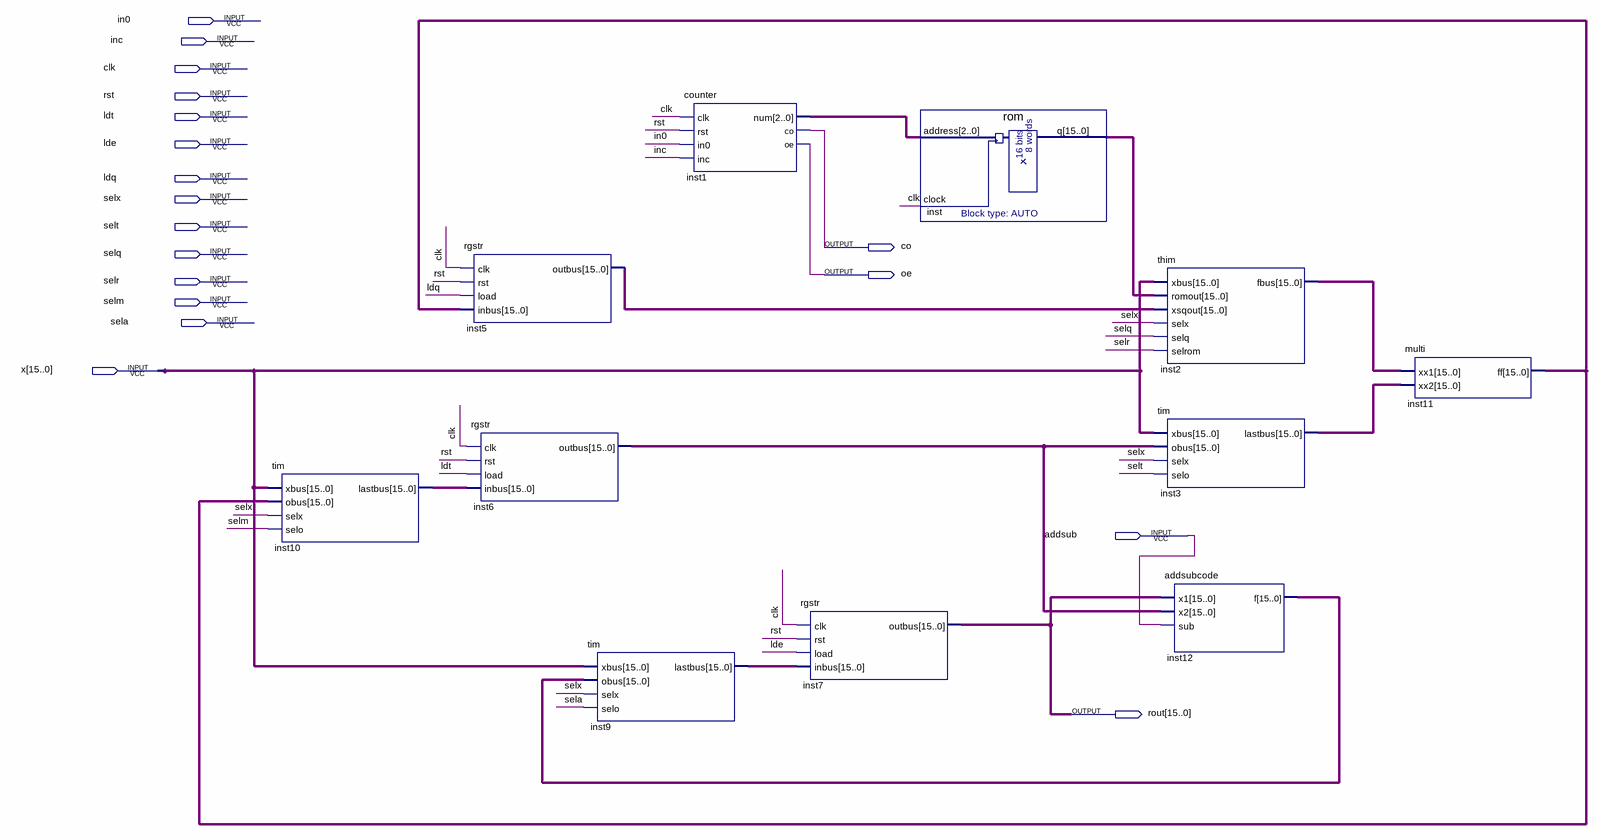
[diagram p0: schematic sheet]
// Quartus schematic datapath.bdf as structural Verilog: 11 symbols, 18 pins
module datapath (
  input  in0,
  input  inc,
  input  clk,
  input  rst,
  input  ldt,
  input  lde,
  input  ldq,
  input  selx,
  input  selt,
  input  selq,
  input  selr,
  input  selm,
  input  sela,
  input  [15:0] x,
  input  addsub,
  output co,
  output oe,
  output [15:0] rout
);

  wire [2:0] inst1_num;
  wire [15:0] inst2_fbus, inst3_lastbus, inst5_outbus, inst6_outbus, inst9_lastbus, inst10_lastbus,
       inst11_ff, inst12_f, inst_q;

  tim inst10 (.xbus(x), .obus(inst11_ff), .selx(selx), .selo(selm), .lastbus(inst10_lastbus));
  rgstr inst5 (.clk(clk), .rst(rst), .load(ldq), .inbus(inst11_ff), .outbus(inst5_outbus));
  rgstr inst6 (.clk(clk), .rst(rst), .load(ldt), .inbus(inst10_lastbus), .outbus(inst6_outbus));
  tim inst9 (.xbus(x), .obus(inst12_f), .selx(selx), .selo(sela), .lastbus(inst9_lastbus));
  counter inst1 (.clk(clk), .rst(rst), .in0(in0), .inc(inc), .num(inst1_num), .co(co), .oe(oe));
  rgstr inst7 (.clk(clk), .rst(rst), .load(lde), .inbus(inst9_lastbus), .outbus(rout));
  rom inst (.address(inst1_num), .clock(clk), .q(inst_q));
  thim inst2 (
    .xbus(x), .romout(inst_q), .xsqout(inst5_outbus), .selx(selx), .selq(selq), .selrom(selr),
    .fbus(inst2_fbus));
  tim inst3 (.xbus(x), .obus(inst6_outbus), .selx(selx), .selo(selt), .lastbus(inst3_lastbus));
  addsubcode inst12 (.x1(rout), .x2(inst6_outbus), .sub(addsub), .f(inst12_f));
  multi inst11 (.xx1(inst2_fbus), .xx2(inst3_lastbus), .ff(inst11_ff));
endmodule
